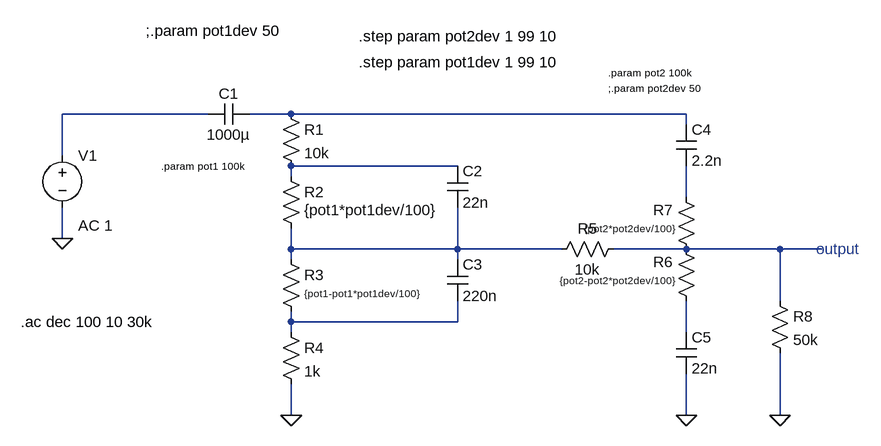
[diagram p0: schematic BAXANDALL TONE CONTROL.asc]
BAXANDALL TONE CONTROL.asc, the LTspice schematic file:
Version 4
SHEET 1 952 680
WIRE -64 96 -288 96
WIRE 64 96 0 96
WIRE 672 96 64 96
WIRE 672 112 672 96
WIRE -288 160 -288 96
WIRE 320 176 64 176
WIRE 64 192 64 176
WIRE 672 224 672 176
WIRE -288 288 -288 240
WIRE 64 304 64 272
WIRE 320 304 320 240
WIRE 320 304 64 304
WIRE 480 304 320 304
WIRE 672 304 560 304
WIRE 816 304 672 304
WIRE 880 304 816 304
WIRE 64 320 64 304
WIRE 320 320 320 304
WIRE 816 384 816 304
WIRE 64 416 64 400
WIRE 320 416 320 384
WIRE 320 416 64 416
WIRE 64 432 64 416
WIRE 672 432 672 384
WIRE 64 560 64 512
WIRE 672 560 672 496
WIRE 816 560 816 464
FLAG -288 288 0
FLAG 64 560 0
FLAG 672 560 0
FLAG 816 560 0
SYMBOL voltage -288 144 R0
WINDOW 123 24 124 Left 2
WINDOW 39 0 0 Left 0
SYMATTR Value2 AC 1
SYMATTR InstName V1
SYMATTR Value ""
SYMBOL cap 0 80 R90
WINDOW 0 0 32 VBottom 2
WINDOW 3 32 32 VTop 2
SYMATTR InstName C1
SYMATTR Value 1000µ
SYMBOL res 48 80 R0
SYMATTR InstName R1
SYMATTR Value 10k
SYMBOL res 48 176 R0
WINDOW 3 36 68 Left 2
SYMATTR Value {pot1*pot1dev/100}
SYMATTR InstName R2
SYMBOL res 48 304 R0
WINDOW 3 36 68 Left 1
SYMATTR Value {pot1-pot1*pot1dev/100}
SYMATTR InstName R3
SYMBOL res 48 416 R0
SYMATTR InstName R4
SYMATTR Value 1k
SYMBOL cap 304 176 R0
SYMATTR InstName C2
SYMATTR Value 22n
SYMBOL cap 304 320 R0
SYMATTR InstName C3
SYMATTR Value 220n
SYMBOL res 576 288 R90
WINDOW 0 0 56 VBottom 2
WINDOW 3 32 56 VTop 2
SYMATTR InstName R5
SYMATTR Value 10k
SYMBOL res 688 400 R180
WINDOW 0 36 76 Left 2
WINDOW 3 36 48 Left 1
SYMATTR InstName R6
SYMATTR Value {pot2-pot2*pot2dev/100}
SYMBOL res 688 320 R180
WINDOW 0 36 76 Left 2
WINDOW 3 36 48 Left 1
SYMATTR InstName R7
SYMATTR Value {pot2*pot2dev/100}
SYMBOL cap 656 112 R0
SYMATTR InstName C4
SYMATTR Value 2.2n
SYMBOL cap 656 432 R0
SYMATTR InstName C5
SYMATTR Value 22n
SYMBOL res 800 368 R0
SYMATTR InstName R8
SYMATTR Value 50k
TEXT 872 304 Left 2 ;output
TEXT -136 176 Left 1 !.param pot1 100k
TEXT 552 32 Left 1 !.param pot2 100k
TEXT -160 -32 Left 2 !;.param pot1dev 50
TEXT 552 56 Left 1 !;.param pot2dev 50
TEXT -352 416 Left 2 !.ac dec 100 10 30k
TEXT 168 -24 Left 2 !.step param pot2dev 1 99 10
TEXT 168 16 Left 2 !.step param pot1dev 1 99 10

The netlist it stands for:
* BAXANDALL TONE CONTROL.asc
V1 N001 0 AC 1
C1 N002 N001 1000µ
R1 N002 N003 10k
R2 N003 N005 {pot1*pot1dev/100}
R3 N005 N007 {pot1-pot1*pot1dev/100}
R4 N007 0 1k
C2 N003 N005 22n
C3 N005 N007 220n
R5 N006 N005 10k
R6 N008 N006 {pot2-pot2*pot2dev/100}
R7 N006 N004 {pot2*pot2dev/100}
C4 N002 N004 2.2n
C5 N008 0 22n
R8 N006 0 50k
* output
.param pot1 100k
.param pot2 100k
;.param pot1dev 50
;.param pot2dev 50
.ac dec 100 10 30k
.step param pot2dev 1 99 10
.step param pot1dev 1 99 10
.backanno
.end